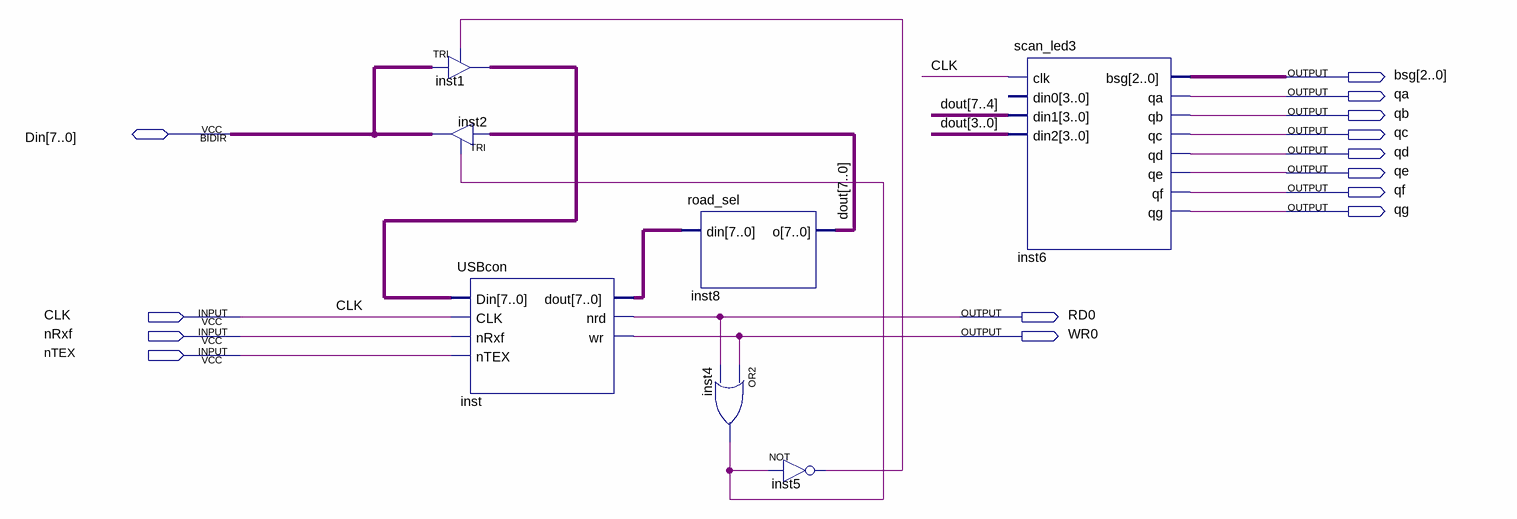
[diagram p0: schematic sheet]
// Quartus schematic CRC.bdf as structural Verilog: 7 symbols, 14 pins
module CRC (
  input  CLK,
  input  nRxf,
  input  nTEX,
  inout  [7:0] Din,
  output [2:0] bsg,
  output qa,
  output qb,
  output qc,
  output qd,
  output qe,
  output qf,
  output qg,
  output RD0,
  output WR0
);

  wire inst4_out, inst5_out;
  wire [7:0] dout, inst1_out, inst_dout;

  TRI inst1[7:0] (.IN(Din), .OE(inst5_out), .OUT(inst1_out));
  TRI inst2[7:0] (.IN(dout), .OE(inst4_out), .OUT(Din));
  USBcon inst (.Din(inst1_out), .CLK(CLK), .nRxf(nRxf), .nTEX(nTEX), .dout(inst_dout), .nrd(RD0), .wr(WR0));
  road_sel inst8 (.din(inst_dout), .o(dout));
  or inst4 (inst4_out, WR0, RD0);
  not inst5 (inst5_out, inst4_out);
  scan_led3 inst6 (
    .clk(CLK), .din1(dout[7:4]), .din2(dout[3:0]), .bsg(bsg), .qa(qa), .qb(qb), .qc(qc), .qd(qd), .qe(qe),
    .qf(qf), .qg(qg));  // open: din0
endmodule
